# EAGLE schematic Smart Driver Health and Safety System (EAGLE 9.6.2)
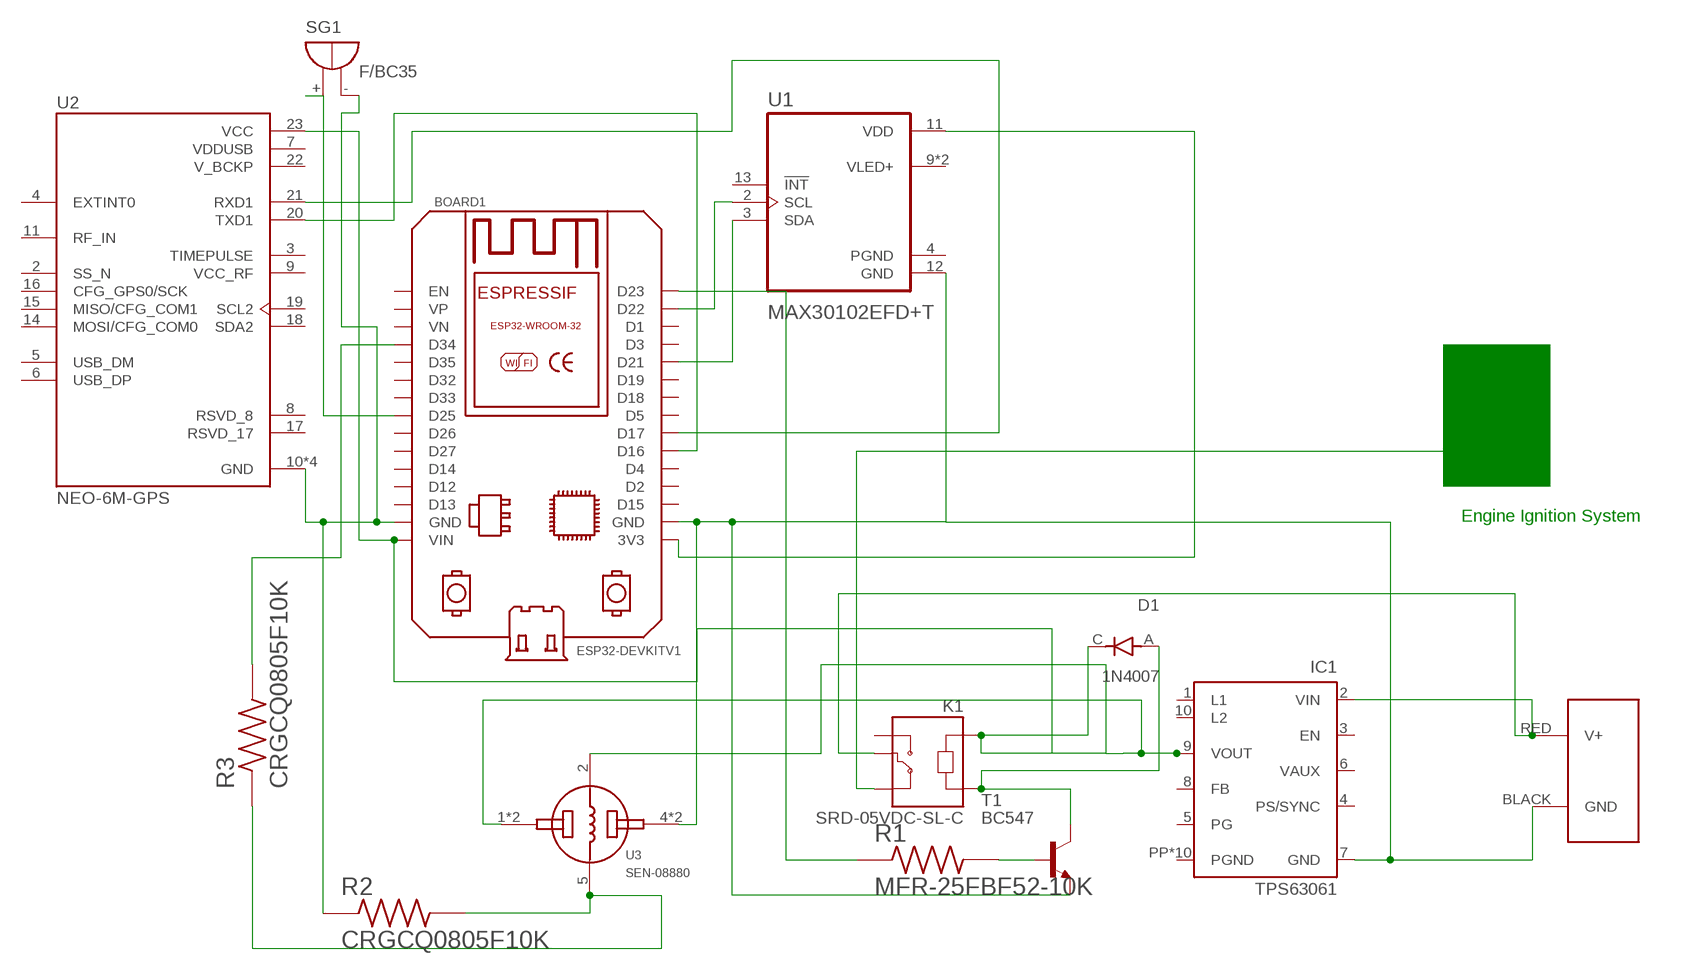
[diagram p0: schematic, sheet 1]

## Parts
BOARD1  ESP32DEVKITV1  [ESP32-DEVKITV1]
D1  1N4007  [DIOAD1060W80L520D270]
IC1  TPS63061  [DSC-S-PWSON-N10]
J1  POWERPOLE_POWER10AWG  [POWERPOLE_PAIR_10AWG]
K1  SRD-05VDC-SL-C  [RELAY_SRD-05VDC-SL-C]
R1  MFR-25FBF52-10K  [RESAD1100W55L680D260]
R2  CRGCQ0805F10K  [RESC2012X65N]
R3  CRGCQ0805F10K  [RESC2012X65N]
SG1  F/BC35  [F/BC35]
T1  BC547  [TO92]
U1  MAX30102EFD+T  [XDCR_MAX30101EFD+]
U2  NEO-6M-GPS  [XCVR_NEO-6M-GPS]
U3  SEN-08880  [XDCR_SEN-08880]

## Nets
N$1: BOARD1.3V3 U1.11(VDD)
N$2: BOARD1.GND@1(GND) IC1.7(GND) J1.BLACK(GND) T1.1(E) U1.12(GND) U3.4(B) U3.6(B)
N$3: BOARD1.D21 U1.3(SDA)
N$4: BOARD1.D22 U1.2(SCL)
N$5: D1.A K1.A2 T1.3(C)
N$6: BOARD1.GND R2.1 SG1.- U2.10(GND) U2.12(GND) U2.13(GND) U2.24(GND)
N$7: BOARD1.D16 U2.20(TXD1)
N$8: BOARD1.D17 U2.21(RXD1)
N$9: IC1.2(VIN) J1.RED(V+) K1.COM
N$10: R1.2 T1.2(B)
N$11: BOARD1.D34 R3.2
N$12: BOARD1.D23 R1.1
N$13: BOARD1.D25 SG1.+
N$14: BOARD1.VIN D1.C IC1.9(VOUT) K1.A1 U2.23(VCC) U3.1(A) U3.2(H1) U3.3(A)
N$15: R2.2 R3.1 U3.5(H2)
N$17: K1.NC
Unconnected: BOARD1.D1 BOARD1.D2 BOARD1.D3 BOARD1.D4 BOARD1.D5 BOARD1.D12 BOARD1.D13 BOARD1.D14 BOARD1.D15 BOARD1.D18 BOARD1.D19 BOARD1.D26 BOARD1.D27 BOARD1.D32 BOARD1.D33 BOARD1.D35 BOARD1.EN BOARD1.VN BOARD1.VP IC1.1(L1) IC1.3(EN) IC1.4(PS/SYNC) IC1.5(PG) IC1.8(FB) IC1.10(L2) K1.NO U1.13(!INT) U2.2(SS_N) U2.3(TIMEPULSE) U2.4(EXTINT0) U2.5(USB_DM) U2.6(USB_DP) U2.8(RSVD_8) U2.9(VCC_RF) U2.11(RF_IN) U2.14(MOSI/CFG_COM0) U2.15(MISO/CFG_COM1) U2.16(CFG_GPS0/SCK) U2.17(RSVD_17) U2.18(SDA2) U2.19(SCL2)

## Notes on the sheet
- Engine Ignition System

## Power pins joined to a net without a drawn wire
PGND: IC1.PP(PGND) IC1.PP@1(PGND) IC1.PP@2(PGND) IC1.PP@3(PGND) IC1.PP@4(PGND) IC1.PP@5(PGND) IC1.PP@7(PGND) IC1.PP@8(PGND) IC1.PP@9(PGND) IC1.PP@10(PGND) U1.4(PGND)
V_BCKP: U2.22(V_BCKP)
VAUX: IC1.6(VAUX)
VDDUSB: U2.7(VDDUSB)
VLED+: U1.9(VLED+) U1.10(VLED+)

## Library data of the parts
BOARD1 = ESP32-DEVKITV1:ESP32DEVKITV1: https://github.com/shridattdudhat
D1 = 1N4007:1N4007: Check availability <https://pricing.snapeda.com/parts/1N4007/ON%20Semiconductor/view-part?ref=eda>; AVAILABILITY: In Stock; CHECK_PRICES: https://www.snapeda.com/parts/1N4007/Onsemi/view-part/?ref=eda; DESCRIPTION: Diode Standard 1000V 1A Through Hole DO-204AL (DO-41); MF: ON Semiconductor; MP: 1N4007; PACKAGE: DO-41-2 ON Semiconductor; PRICE: None; SNAPEDA_LINK: https://www.snapeda.com/parts/1N4007/Onsemi/view-part/?ref=snap
IC1 = texas:TPS6306*: HIGH INPUT VOLTAGE BUCK-BOOST CONVERTER WITH 2A SWITCH CURRENT Source: http://www.ti.com/lit/ds/symlink/tps63060.pdf
J1 = powerpoles:POWERPOLE_POWER: Anderson Powerpole Power Connector using ameteur radio standard layout
K1 = SRD-05VDC-SL-C:SRD-05VDC-SL-C: Check availability <https://pricing.snapeda.com/parts/SRD-05VDC-SL-C/Songle%20Relay/view-part?ref=eda>; AVAILABILITY: In Stock; CHECK_PRICES: https://www.snapeda.com/parts/SRD-05VDC-SL-C/Songle+Relay/view-part/?ref=eda; DESCRIPTION: 5V Trigger Relay Module For Arduino And Raspberry Pi 5V Trigger Relay Module For Arduino And Raspberry Pi; MF: Songle Relay; MP: SRD-05VDC-SL-C; PACKAGE: NON STANDARD-5 Songle Relay; PRICE: None; SNAPEDA_LINK: https://www.snapeda.com/parts/SRD-05VDC-SL-C/Songle+Relay/view-part/?ref=snap
R1 = MFR-25FBF52-10K:MFR-25FBF52-10K: Check availability <https://pricing.snapeda.com/parts/MFR-25FBF52-10K/Yageo/view-part?ref=eda>; AVAILABILITY: In Stock; CHECK_PRICES: https://www.snapeda.com/parts/MFR-25FBF52-10K/Yageo/view-part/?ref=eda; DESCRIPTION: 10.2 kOhms ±1% 0.25W, 1/4W Through Hole Resistor Axial - Metal Film; MF: Yageo; MP: MFR-25FBF52-10K; PACKAGE: RADIAL-2 Yageo; PRICE: None; SNAPEDA_LINK: https://www.snapeda.com/parts/MFR-25FBF52-10K/Yageo/view-part/?ref=snap
R2 R3 = CRGCQ0805F10K:CRGCQ0805F10K: Check availability <https://pricing.snapeda.com/parts/CRGCQ0805F10K/TE%20Connectivity/view-part?ref=eda>; AVAILABILITY: In Stock; CHECK_PRICES: https://www.snapeda.com/parts/CRGCQ0805F10K/TE+Connectivity/view-part/?ref=eda; COMMENT: 3-2176341-7; DESCRIPTION: 10 kOhms ±1% 0.125W, 1/8W Chip Resistor 0805 (2012 Metric) Automotive AEC-Q200, Moisture Resistant Thick Film; MF: TE Connectivity; MP: CRGCQ0805F10K; PACKAGE: 2012 TE Connectivity; PRICE: None; SNAPEDA_LINK: https://www.snapeda.com/parts/CRGCQ0805F10K/TE+Connectivity/view-part/?ref=snap
SG1 = buzzer:F/BC35: BUZZER Source: Spoerle; OC_FARNELL: unknown; OC_NEWARK: unknown
T1 = transistor:BC547: NPN TRANSISTOR
U1 = MAX30102EFD_T:MAX30102EFD+T: Check availability <https://pricing.snapeda.com/parts/MAX30102EFD%2BT/Analog%20Devices/view-part?ref=eda>; AVAILABILITY: In Stock; CHECK_PRICES: https://www.snapeda.com/parts/MAX30102EFD+T/Analog+Devices/view-part/?ref=eda; DESCRIPTION: High-Sensitivity Pulse Oximeter and Heart-Rate Sensor for Wearable Health; MF: Analog Devices; MP: MAX30102EFD+T; PACKAGE: OLGA-14 Maxim; PRICE: None; SNAPEDA_LINK: https://www.snapeda.com/parts/MAX30102EFD+T/Analog+Devices/view-part/?ref=snap
U2 = NEO-6M-GPS:NEO-6M-GPS: Check availability <https://pricing.snapeda.com/parts/NEO-6M-GPS/u-blox/view-part?ref=eda>; AVAILABILITY: Not in stock; CHECK_PRICES: https://www.snapeda.com/parts/NEO-6M-GPS/u-blox/view-part/?ref=eda; DESCRIPTION: GPS Development Tools SparkFun GNSS-RTK Dead Reckoning Breakout - ZED-F9K (Qwiic); MF: u-blox; MP: NEO-6M-GPS; PACKAGE: None; PRICE: None; SNAPEDA_LINK: https://www.snapeda.com/parts/NEO-6M-GPS/u-blox/view-part/?ref=snap
U3 = SEN-08880:SEN-08880: Check availability <https://pricing.snapeda.com/parts/SEN-08880/SparkFun%20Electronics/view-part?ref=eda>; AVAILABILITY: Not in stock; CHECK_PRICES: https://www.snapeda.com/parts/SEN-08880/SparkFun/view-part/?ref=eda; DESCRIPTION: Alcohol (C2H6O) Sensor 0 V ~ 3.3 V; MF: SparkFun Electronics; MP: SEN-08880; PACKAGE: None; PRICE: None; SNAPEDA_LINK: https://www.snapeda.com/parts/SEN-08880/SparkFun/view-part/?ref=snap